# Altium schematic sheet Mic_Circuit.SchDoc
size A
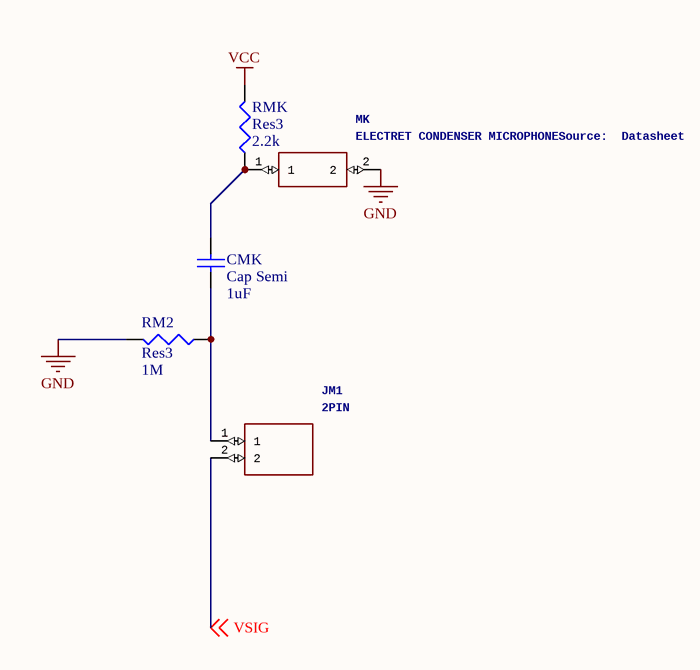
[diagram p0: Mic_Circuit.SchDoc]

## Parts
CMK  Cap Semi  value 1uF  [1608[0603]]
JM1  2PIN  [HDRV2W110P0X254_1X2_508X254X85]
MK  ELECTRET CONDENSER MICROPHONESource:  Datasheet  [CMA-4544PF-W]
RM2  Res3  value 1M  [1608[0603]]
RMK  Res3  value 2.2k  [1608[0603]]

## Nets
GND: MK.2 RM2.1
VCC: RMK.1
VSIG: JM1.2 ; off-sheet VSIG
NetCMK_1: CMK.1 JM1.1 RM2.2
NetCMK_2: CMK.2 MK.1 RMK.2

## Library data of the parts
CMK = Cap Semi: Capacitor (Semiconductor SIM Model); Published: 8-Jun-2000; LatestRevisionDate: 29-May-2009; LatestRevisionNote: IPC-7351 Footprint Added.; PackageReference: C1206; Publisher: Altium Limited; PackageDescription: Chip Capacitor
JM1 = 61300211121: Manufacturer_Name: Wurth Elektronik; GateName_1: G$1; SymbolName_1: 61300211121; LibraryName: 61300211121; DeviceSetName: 61300211121; Package: HDRV2W110P0X254_1X2_508X254X85; Manufacturer_Part_Number: 61300211121; RS_Part_Number: 8281581P; RS_Price-Stock: http://uk.rs-online.com/web/p/products/8281581P; Arrow_Part_Number: 61300211121; Arrow_Price-Stock: http://uk.rs-online.com/web/p/products/8281581P; Height: 8.54mm
MK = CMA-4544PF-W: Manufacturer_Name: CUI; GateName_1: G$1; SymbolName_1: CMA-4544PF-W; LibraryName: CMA-4544PF-W; DeviceSetName: CMA-4544PF-W; Package: CMA-4544PF-W; Manufacturer_Part_Number: CMA-4544PF-W; Arrow_Part_Number: CMA-4544PF-W; Arrow_Price-Stock: https://www.arrow.com/en/products/cma-4544pf-w/cui-inc; Height: mm
RM2 RMK = Res3: Resistor; Published: 8-Jun-2000; LatestRevisionDate: 29-May-2009; LatestRevisionNote: IPC-7351 Footprint Added.; PackageReference: J1-0603; Publisher: Altium Limited; PackageDescription: Chip Resistor